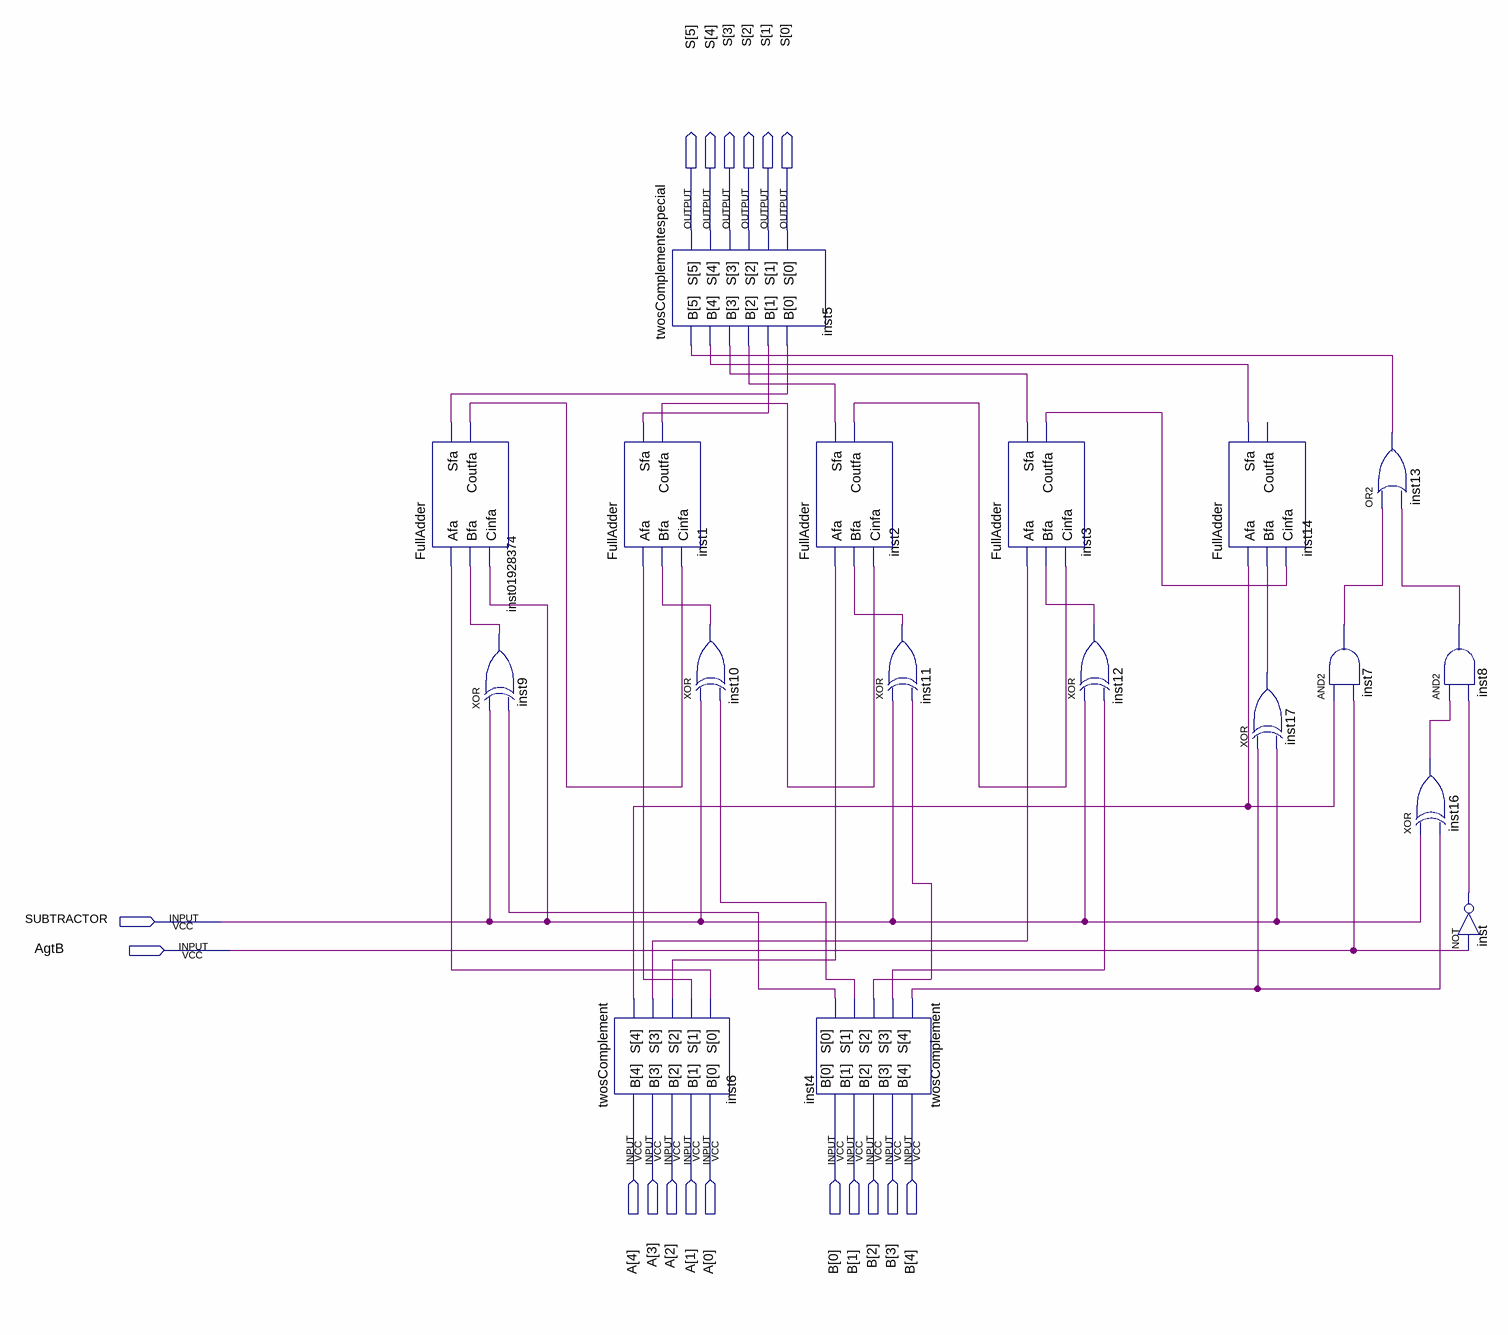
[diagram p0: schematic sheet]
// Quartus schematic summer_subtractor.bdf as structural Verilog: 18 symbols, 18 pins
module summer_subtractor (
  input  SUBTRACTOR,
  input  AgtB,
  input  [4:0] A,
  input  [4:0] B,
  output [5:0] S
);

  wire inst1_coutfa, inst1_sfa, inst2_coutfa, inst2_sfa, inst3_coutfa, inst3_sfa, inst4_s, inst4_s_2,
       inst4_s_3, inst4_s_4, inst4_s_5, inst6_s, inst6_s_2, inst6_s_3, inst6_s_4, inst6_s_5, inst7_out,
       inst8_out, inst9_out, inst10_out, inst11_out, inst12_out, inst13_out, inst14_sfa, inst16_out,
       inst17_out, inst01928374_coutfa, inst01928374_sfa, inst_out;

  FullAdder inst01928374 (
    .Afa(inst6_s_3), .Bfa(inst9_out), .Cinfa(SUBTRACTOR), .Sfa(inst01928374_sfa), .Coutfa(inst01928374_coutfa));
  xor inst9 (inst9_out, SUBTRACTOR, inst4_s_4);
  FullAdder inst1 (
    .Afa(inst6_s), .Bfa(inst10_out), .Cinfa(inst01928374_coutfa), .Sfa(inst1_sfa), .Coutfa(inst1_coutfa));
  twosComplement inst6 (.B(A), .S({inst6_s_4, inst6_s_5, inst6_s_2, inst6_s, inst6_s_3}));
  twosComplementespecial inst5 (.B({inst13_out, inst14_sfa, inst3_sfa, inst2_sfa, inst1_sfa, inst01928374_sfa}), .S(S));
  xor inst10 (inst10_out, SUBTRACTOR, inst4_s_3);
  FullAdder inst2 (.Afa(inst6_s_2), .Bfa(inst11_out), .Cinfa(inst1_coutfa), .Sfa(inst2_sfa), .Coutfa(inst2_coutfa));
  twosComplement inst4 (.B(B), .S({inst4_s_5, inst4_s, inst4_s_2, inst4_s_3, inst4_s_4}));
  xor inst11 (inst11_out, SUBTRACTOR, inst4_s_2);
  FullAdder inst3 (.Afa(inst6_s_5), .Bfa(inst12_out), .Cinfa(inst2_coutfa), .Sfa(inst3_sfa), .Coutfa(inst3_coutfa));
  xor inst12 (inst12_out, SUBTRACTOR, inst4_s);
  FullAdder inst14 (.Afa(inst6_s_4), .Bfa(inst17_out), .Cinfa(inst3_coutfa), .Sfa(inst14_sfa));  // open: Coutfa
  xor inst17 (inst17_out, inst4_s_5, SUBTRACTOR);
  and inst7 (inst7_out, inst6_s_4, AgtB);
  or inst13 (inst13_out, inst7_out, inst8_out);
  and inst8 (inst8_out, inst16_out, inst_out);
  xor inst16 (inst16_out, SUBTRACTOR, inst4_s_5);
  not inst (inst_out, AgtB);
endmodule
